# Altium schematic sheet Connectors.SchDoc
size 420 x 297 mm; Address1: Address1; Address2: Address2; Address3: Address3; Address4: Address4; SheetNumber: 2; SheetTotal: 2; Scale: 1:1; Обозначение документа: АБВГ.123456.001 Э3
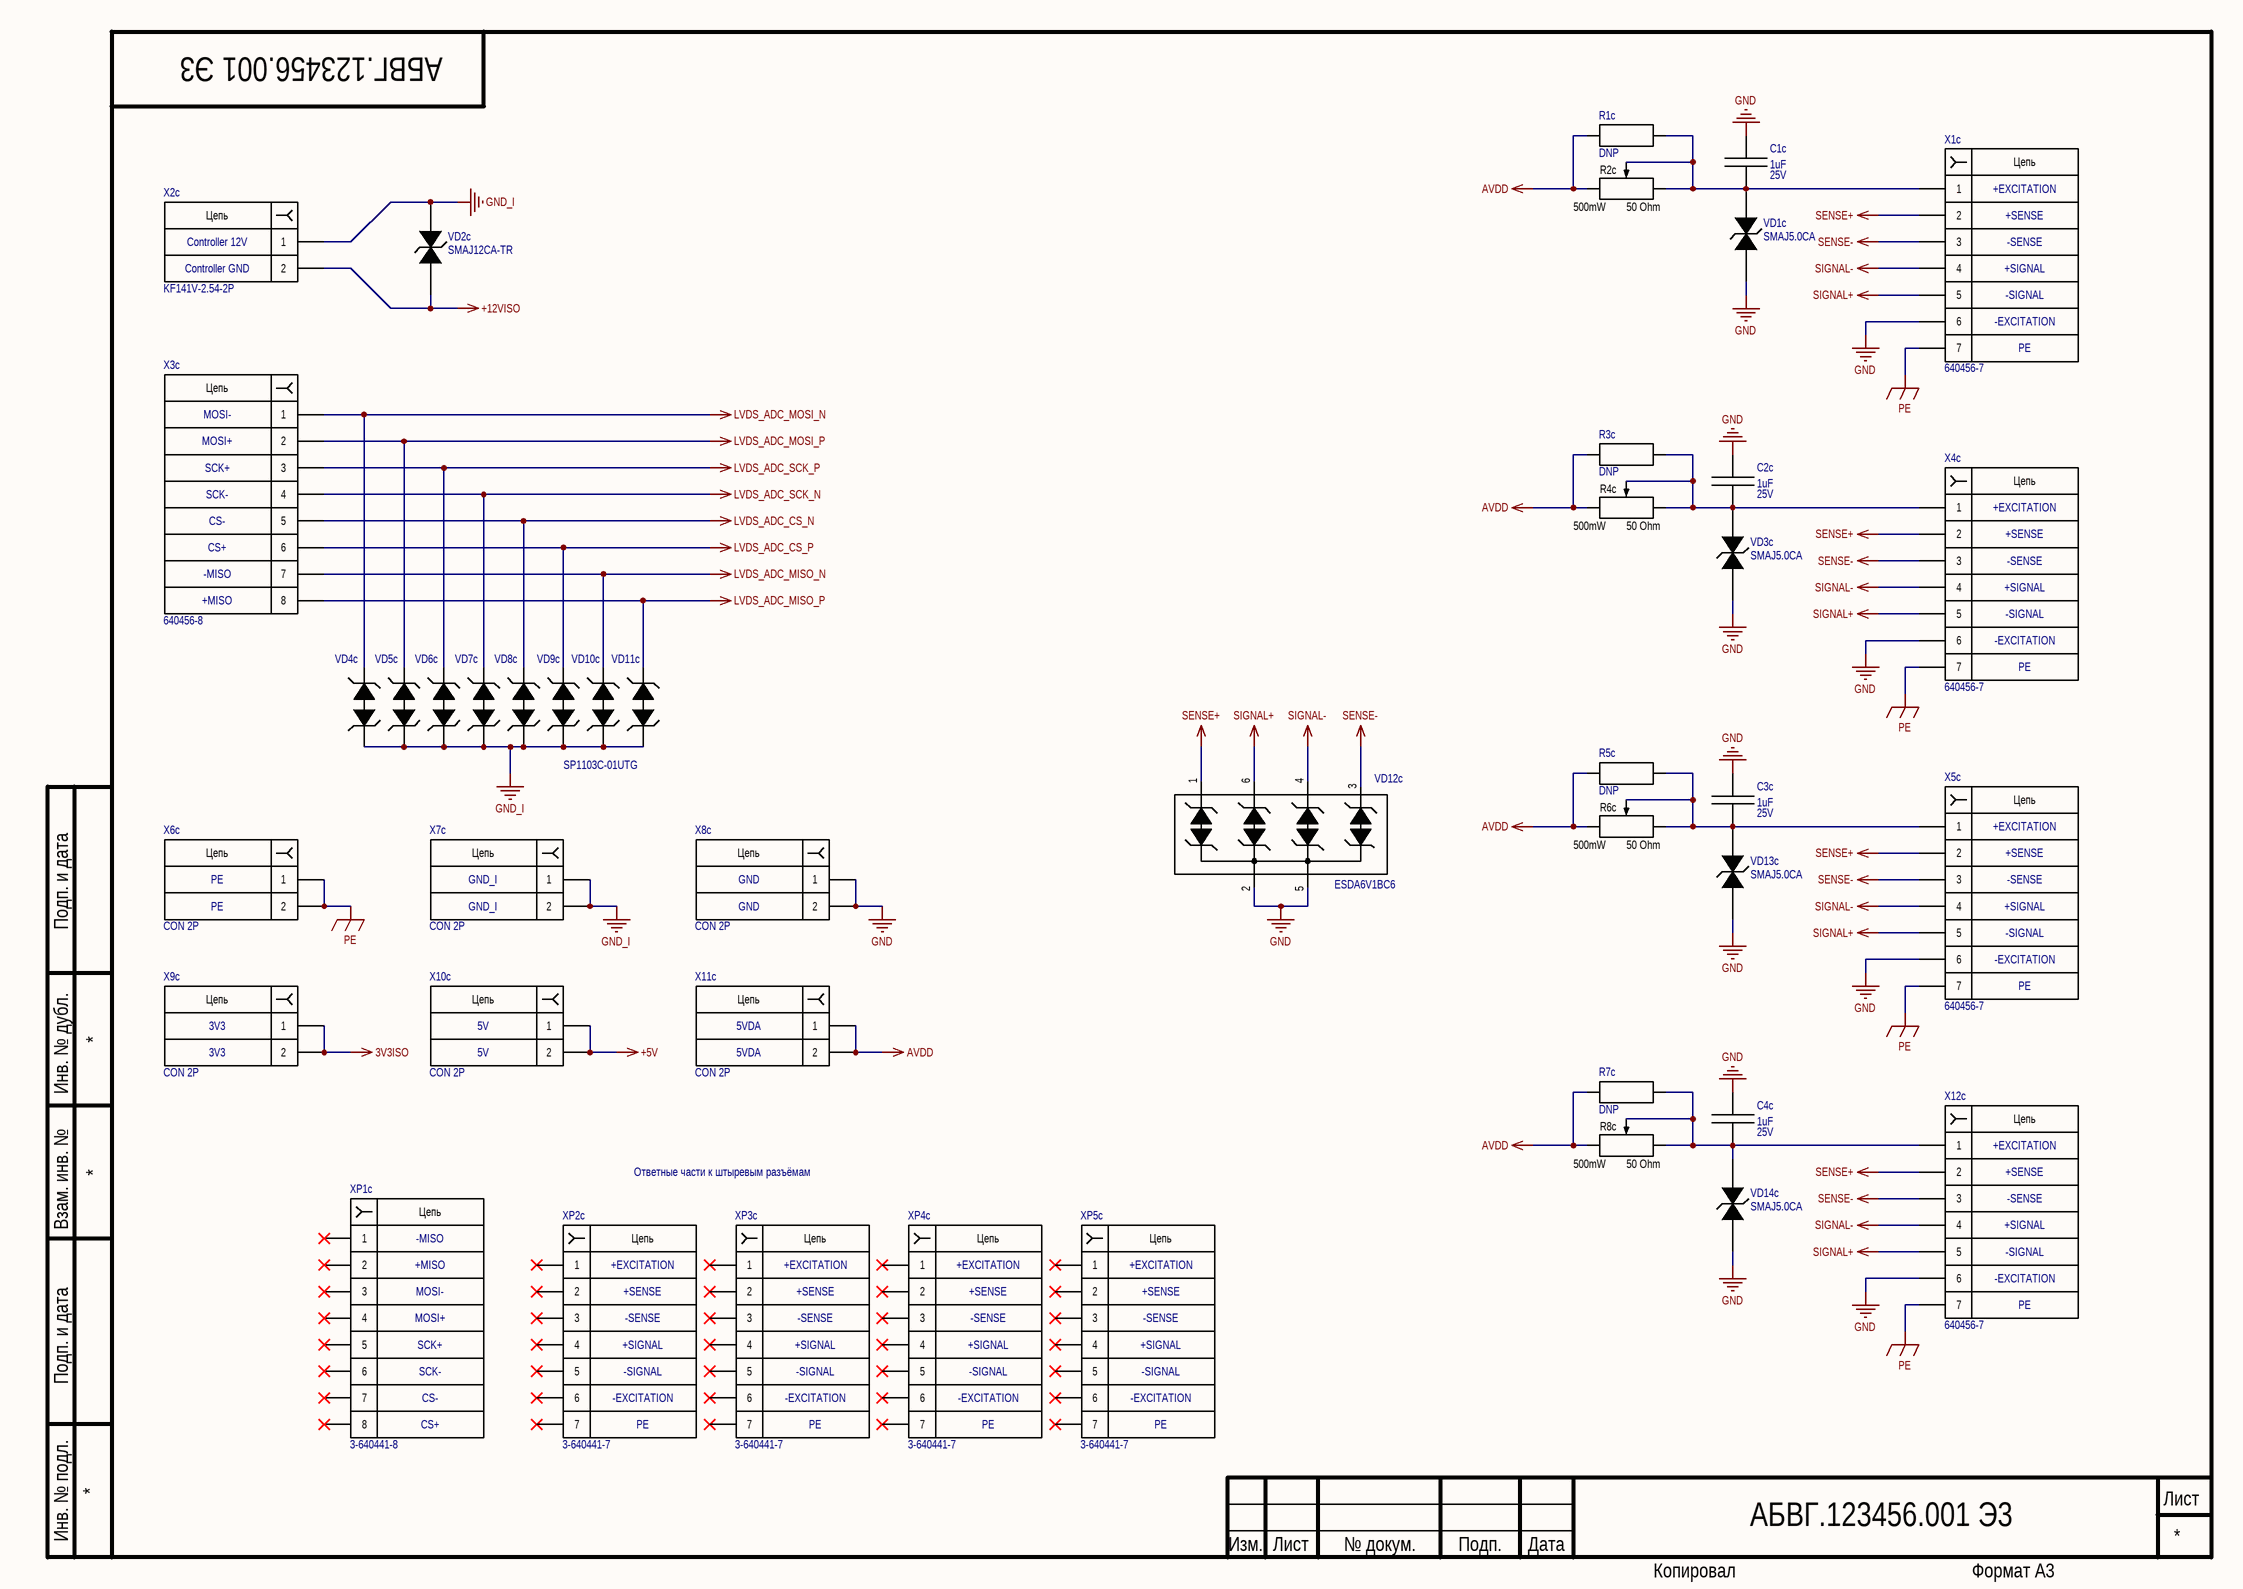
[diagram p0: Connectors.SchDoc]

## Parts
C1c  Capacitance: 1uF  Rated Voltage: 25V  [CAP 0603 IPC MAX]  (hidden comment: TMK107BJ105KA-T)
C2c  Capacitance: 1uF  Rated Voltage: 25V  [CAP 0603 IPC MAX]  (hidden comment: TMK107BJ105KA-T)
C3c  Capacitance: 1uF  Rated Voltage: 25V  [CAP 0603 IPC MAX]  (hidden comment: TMK107BJ105KA-T)
C4c  Capacitance: 1uF  Rated Voltage: 25V  [CAP 0603 IPC MAX]  (hidden comment: TMK107BJ105KA-T)
R1c  DNP  [RES 0603 IPC MAX]  (no BOM)
R2c  Rated Power: 500mW  Resistance: 50 Ohm  [RES: 3296W]  (hidden comment: PV36W500C01B00)
R3c  DNP  [RES 0603 IPC MAX]  (no BOM)
R4c  Rated Power: 500mW  Resistance: 50 Ohm  [RES: 3296W]  (hidden comment: PV36W500C01B00)
R5c  DNP  [RES 0603 IPC MAX]  (no BOM)
R6c  Rated Power: 500mW  Resistance: 50 Ohm  [RES: 3296W]  (hidden comment: PV36W500C01B00)
R7c  DNP  [RES 0603 IPC MAX]  (no BOM)
R8c  Rated Power: 500mW  Resistance: 50 Ohm  [RES: 3296W]  (hidden comment: PV36W500C01B00)
VD1c  SMAJ5.0CA  [DO-214AC Bidirectional]
VD2c  SMAJ12CA-TR  [DO-214AC Bidirectional]
VD3c  SMAJ5.0CA  [DO-214AC Bidirectional]
VD4c  SP1103C-01UTG  [2-DFN 1.6x1.0]  (value not drawn)
VD5c  SP1103C-01UTG  [2-DFN 1.6x1.0]  (value not drawn)
VD6c  SP1103C-01UTG  [2-DFN 1.6x1.0]  (value not drawn)
VD7c  SP1103C-01UTG  [2-DFN 1.6x1.0]  (value not drawn)
VD8c  SP1103C-01UTG  [2-DFN 1.6x1.0]  (value not drawn)
VD9c  SP1103C-01UTG  [2-DFN 1.6x1.0]  (value not drawn)
VD10c  SP1103C-01UTG  [2-DFN 1.6x1.0]  (value not drawn)
VD11c  SP1103C-01UTG  [2-DFN 1.6x1.0]
VD12c  ESDA6V1BC6  [SOT-23-6]
VD13c  SMAJ5.0CA  [DO-214AC Bidirectional]
VD14c  SMAJ5.0CA  [DO-214AC Bidirectional]
X1c  640456-7  [640456-7]
X2c  KF141V-2.54-2P  [KF141V-2.54-2P]
X3c  640456-8  [640456-8]
X4c  640456-7  [640456-7]
X5c  640456-7  [640456-7]
X6c  CON 2P  [2P TH 2.54mm]  (no BOM)
X7c  CON 2P  [2P TH 2.54mm]  (no BOM)
X8c  CON 2P  [2P TH 2.54mm]  (no BOM)
X9c  CON 2P  [2P TH 2.54mm]  (no BOM)
X10c  CON 2P  [2P TH 2.54mm]  (no BOM)
X11c  CON 2P  [2P TH 2.54mm]  (no BOM)
X12c  640456-7  [640456-7]
XP1c  3-640441-8  (mechanical)
XP2c  3-640441-7  (mechanical)
XP3c  3-640441-7  (mechanical)
XP4c  3-640441-7  (mechanical)
XP5c  3-640441-7  (mechanical)

## Nets
3V3ISO: X9c.1 X9c.2
+5V: X10c.1 X10c.2
+12VISO: VD2c.1 X2c.2
AVDD: R1c.1 R2c.1 R3c.1 R4c.1 R5c.1 R6c.1 R7c.1 R8c.1 X11c.1 X11c.2
GND: C1c.1 C2c.1 C3c.1 C4c.1 VD1c.1 VD3c.1 VD12c.2 VD12c.5 VD13c.1 VD14c.1 X1c.6 X4c.6 X5c.6 X8c.1 X8c.2 X12c.6
GND_I: VD2c.2 VD4c.1 VD5c.1 VD6c.1 VD7c.1 VD8c.1 VD9c.1 VD10c.1 VD11c.1 X2c.1 X7c.1 X7c.2
LVDS_ADC_CS_N: VD8c.2 X3c.5
LVDS_ADC_CS_P: VD9c.2 X3c.6
LVDS_ADC_MISO_N: VD10c.2 X3c.7
LVDS_ADC_MISO_P: VD11c.2 X3c.8
LVDS_ADC_MOSI_N: VD4c.2 X3c.1
LVDS_ADC_MOSI_P: VD5c.2 X3c.2
LVDS_ADC_SCK_N: VD7c.2 X3c.4
LVDS_ADC_SCK_P: VD6c.2 X3c.3
PE: X1c.7 X4c.7 X5c.7 X6c.1 X6c.2 X12c.7
SENSE+: VD12c.1 X1c.2 X4c.2 X5c.2 X12c.2
SENSE-: VD12c.3 X1c.3 X4c.3 X5c.3 X12c.3
SIGNAL+: VD12c.6 X1c.5 X4c.5 X5c.5 X12c.5
SIGNAL-: VD12c.4 X1c.4 X4c.4 X5c.4 X12c.4
NetC1c_2: C1c.2 R1c.2 R2c.2 R2c.3 VD1c.2 X1c.1
NetC2c_2: C2c.2 R3c.2 R4c.2 R4c.3 VD3c.2 X4c.1
NetC3c_2: C3c.2 R5c.2 R6c.2 R6c.3 VD13c.2 X5c.1
NetC4c_2: C4c.2 R7c.2 R8c.2 R8c.3 VD14c.2 X12c.1

Not connected (* = marked no-connect by the designer): XP1c 1* 2* 3* 4* 5* 6* 7* 8*; XP2c 1* 2* 3* 4* 5* 6* 7*; XP3c 1* 2* 3* 4* 5* 6* 7*; XP4c 1* 2* 3* 4* 5* 6* 7*; XP5c 1* 2* 3* 4* 5* 6* 7*

## Notes on the sheet
- (near X1c) +EXCITATION
- (near X2c) Controller 12V
- -SENSE
- +SENSE
- (near X2c) Controller GND
- (near X1c) -EXCITATION
- -SIGNAL
- +SIGNAL
- PE
- MOSI-
- MOSI+
- SCK+
- SCK-
- CS-
- (near X4c) +EXCITATION
- -MISO
- +MISO
- CS+
- (near X4c) -EXCITATION
- (near X5c) +EXCITATION
- GND_I
- GND
- (near X5c) -EXCITATION
- 3V3
- 5V
- 5VDA
- Ответные части к штыревым разъёмам
- (near X12c) +EXCITATION
- +EXCITATION
- (near XP5c) +EXCITATION
- (near X12c) -EXCITATION
- -EXCITATION
- (near XP5c) -EXCITATION
- Подп. и дата
- Инв. № дубл.
- Взам. инв. №
- Инв. № подл.
- Изм.
- Лист
- № докум.
- Подп.
- Дата
- Копировал
- Формат А3
- (in symbol 2P CONNECTOR) Цепь
- (in symbol 3-640441-7) Цепь
- (in symbol 3-640441-8) Цепь
- (in symbol 640456-7) Цепь
- (in symbol 640456-8) Цепь
- (in symbol KF141V-2.54-2P) Цепь

## Library data of the parts
C1c C2c C3c C4c = TMK107BJ105KA-T: CAP SMD CER 1UF 25V X5R 0603; Manufacturer 1: Taiyo Yuden; Tolerance: 10%; Type: Multilayer Ceramic; Manufacturer Part Number 1: TMK107BJ105KA-T; Min Operating Temperature: -55°C; Max Operating Temperature: 85°C; Mounting: SM; Package: 0603; Supplier 1: Digi-Key; Supplier Part Number 1: 587-1248-1-ND
R1c R3c R5c R7c = RES GOST: RES SMD/TH ?R (&K) OHM ?% ?W (PACKAGE)
R2c R4c R6c R8c = PV36W500C01B00: TRIMMER 50 OHM 0.5W PC PIN TOP; Manufacturer 1: Bourns Inc.; Tolerance: 10%; Manufacturer Part Number 1: PV36W500C01B00; HelpURL: https://www.digikey.com/en/products/detail/bourns-inc/PV36W500C01B00/666513; Supplier 1: Digi-Key; Supplier Part Number 1: 490-2886-ND
VD1c VD3c VD13c VD14c = SMAJ5.0CA: TVS DIODE 5VWM 9.2VC DO214AC; Manufacturer 1: Littelfuse Inc.; Voltage - Reverse Standoff (Typ): 5V; Voltage - Breakdown (Min): 6.4V; Voltage - Clamping (Max) @ Ipp: 9.2V; Current - Peak Pulse (10/1000µs): 28A (8/20µs); Type: Biderectional; Number Of Chanels: 6; Max Pulse Power: 350W; Manufacturer Part Number 1: SMAJ5.0CA; Mounting: 43.5A; Max Operating Temperature: 150°C; Min Operating Temperature: -65°C; Package: SMA; Supplier 1: Digi-Key; Supplier Part Number 1: SMAJ5.0CABCT-ND
VD2c = SMAJ12CA-TR: TVS DIODE 12VWM 25.3VC SMA; Manufacturer 1: STMicroelectronics; Voltage - Reverse Standoff (Typ): 12V; Voltage - Breakdown (Min): 13.3V; Voltage - Clamping (Max) @ Ipp: 25.3V; Current - Peak Pulse (8/20µs): 91A; Type: Biderectional; Number Of Chanels: 1; Max Pulse Power: 400W; Manufacturer Part Number 1: SMAJ12CA-TR; Mounting: SM; Max Operating Temperature: 150°C; Min Operating Temperature: -55°C; Package: SMA; Supplier 1: Digi-Key; Supplier Part Number 1: 497-2996-1-ND
VD4c VD5c VD6c VD7c VD8c VD9c VD10c VD11c = SP1103C-01UTG: TVS DIODE 3.3VWM 9VC 2DFN; Manufacturer 1: Littelfuse Inc.; Voltage - Reverse Standoff (Typ): 3.3V; Voltage - Breakdown (Min): 3.4V; Voltage - Clamping (Max) @ Ipp: 9V; Current - Peak Pulse (10/1000µs): 80A (8/20µs); Type: Biderectional; Number Of Chanels: 1; Max Pulse Power: 720W; Manufacturer Part Number 1: SP1103C-01UTG; Mounting: SM; Max Operating Temperature: 125°C; Min Operating Temperature: -40°C; Package: 0603; Supplier 1: Digi-Key; Supplier Part Number 1: F10154CT-ND
VD12c = ESDA6V1BC6: TVS DIODE 5VWM SOT23-6; Manufacturer 1: STMicroelectronics; Voltage - Reverse Standoff (Typ): 5V; Voltage - Breakdown (Min): 6.1V; Type: Biderectional; Number Of Chanels: 4; Max Pulse Power: 80W; Manufacturer Part Number 1: ESDA6V1BC6; Mounting: SM; Max Operating Temperature: 125°C; Min Operating Temperature: -40°C; Package: SOT-23-6; Supplier 1: Digi-Key; Supplier Part Number 1: 497-6635-1-ND
X1c X4c X5c X12c = 640456-7: CONN HEADER VERT 7POS 2.54MM; Manufacturer 1: TE Connectivity AMP Connectors; Rated Voltage: 250V; Rated Current: 2; Suitable Connctor: 3-640441-8; Min Operating Temperatire: -55℃; Max Operating Temperature: 105℃; Pitch: 2.54mm; Pins: 7; Manufacturer Part Number 1: 640456-7; Max Length: 17.78mm; Max Width: 5.715; Max Height: 13.59mm; Supplier 1: Digi-Key; Supplier Part Number 1: A19472-ND
X2c = KF141V-2.54-2P: TERMINAL BLOCK 2 PIN 2.54mm 2A 150V T/H; pin to pad: 1>1+3 2>2+4; Manufacturer 1: CIXI KEFA ELECTRONICS CO.,LTD.; Rated Current: 10A; Suitable Wire: 20...26AWG; Pitch: 2.54mm x 5.08mm; Rated Voltage: 150V; Min Operating Temperatire: -40℃; Max Operating Temperature: 105℃; Pins: 2+2; Manufacturer Part Number 1: KF141V-2.54-2P; Max Length: 7.62; Max Width: 12.7mm; Max Height: 13.8mm
X3c = 640456-8: CONN HEADER VERT 8POS 2.54MM; Manufacturer 1: TE Connectivity AMP Connectors; Rated Voltage: 250V; Rated Current: 10A; Suitable Connctor: 3-640441-8; Min Operating Temperatire: -55℃; Max Operating Temperature: 105℃; Pitch: 2.54mm; Pins: 6; Manufacturer Part Number 1: 640456-8; Max Length: 20.32mm; Max Width: 5.715; Max Height: 13.59mm; Supplier 1: Digi-Key; Supplier Part Number 1: A1924-ND
X6c X7c X8c X9c X10c X11c = 2P CONNECTOR
XP1c = 3-640441-8: CONN RCPT 8POS IDC 24AWG TIN; Manufacturer 1: TE Connectivity AMP Connectors; Pitch: 2.54mm; Number Of Positions: 8; Wire Gauge: 24AWG; Features: Closed End; Min Operating Temperatire: -55℃; Max Operating Temperature: 105℃; Manufacturer Part Number 1: 3-640441-8; Max Length: 20.32mm; Max Width: 6.99mm; Max Height: 13.21mm; Supplier 1: Digi-Key; Supplier Part Number 1: A30984-ND
XP2c XP3c XP4c XP5c = 3-640441-7: CONN RCPT 7POS IDC 24AWG TIN; Manufacturer 1: TE Connectivity AMP Connectors; Pitch: 2.54mm; Number Of Positions: 8; Wire Gauge: 24AWG; Features: Closed End; Min Operating Temperatire: -55℃; Max Operating Temperature: 105℃; Manufacturer Part Number 1: 3-640441-7; Max Length: 17.78mm; Max Width: 6.99mm; Max Height: 13.21mm; Supplier 1: Digi-Key; Supplier Part Number 1: A30983-ND